# Altium schematic sheet I_Sense.SchDoc
size A4
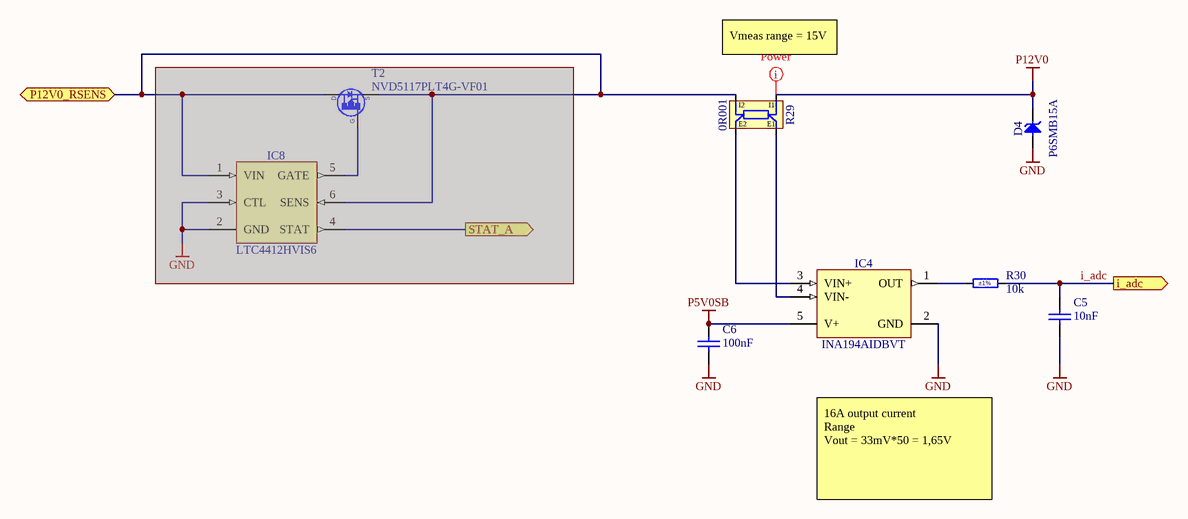
[diagram p0: I_Sense.SchDoc]

## Parts
C5  10nF  [CAPC1608X87N]
C6  100nF  [CAPC1608X87N]
D4  P6SMB15A  [DIOM5436X261N]
IC4  INA194AIDBVT  [SOT95P280X145-5N]
IC8  LTC4412HVIS6  [SOT95P280X100-6N]  (masked out: inside a compile mask, not in the netlist)
R29  0R001  [RES_VISHAY_WSL3637_0R001-0R0019]
R30  10k  Tolerance: ±1%  [RESC1608X55N]
T2  NVD5117PLT4G-VF01  [TO228P990X238-3N-R640X555]  (masked out: inside a compile mask, not in the netlist)

## Ports
i_adc (out), P12V0_RSENS (bidir), STAT_A (out)

## Nets
GND: C5.1 C6.2 D4.2(A) IC4.2(GND)
P5V0SB: C6.1 IC4.5(V+)
P12V0: D4.1(C) R29.I1
i_adc: C5.2 R30.2 ; port i_adc
P12V0_RSENS: R29.I2 ; port P12V0_RSENS
NetIC4_1: IC4.1(OUT) R30.1
NetIC4_3: IC4.3(VIN+) R29.E2
NetIC4_4: IC4.4(VIN-) R29.E1

## Layout directives
net class Power: P12V0

## Notes on the sheet
- (near R29) Vmeas range = 15V
- 16A output current
  Range
  Vout = 33mV*50 = 1,65V

## Library data of the parts
C5 = CC0603_10NF_50V_10%_X7R: Non-polarised capacitor; Part Description: SMD Multilayer Chip Ceramic Capacitor; Manufacturer: GENERIC; Manufacturer1 Part Number: 223858615636; Voltage: 50V; TC: X7R; Tolerance: ±10%; Part Number: CC0603_10NF_50V_10%_X7R; Component Kind: Standard; Component Type: Standard; Pin Count: 2; Value: 10nF; Status: Preferred; Manufacturer Part Number: CC0603_10NF_50V_10%_X7R; Case: 0603; Mounted: Yes; Socket: No; SMD: Yes; Sense: No; Manufacturer1 Example: PHYCOMP; Manufacturer1 ComponentHeight: 0.87mm; HelpURL: \\cern.ch\dfs\Applications\Altium\Datasheets\CC0603_X7R_PHYCOMP.pdf; Author: CERN DEM JLC; CreateDate: 03.12.2007; LatestRevisionDate: 03.12.2007
C6 = CC0603_100NF_50V_10%_X5R: Non-polarised capacitor; Part Description: SMD Multilayer Chip Ceramic Capacitor; Manufacturer: GENERIC; Manufacturer1 Part Number: C1608X5R1H104K080; Voltage: 50V; TC: X5R; Tolerance: ±10%; Part Number: CC0603_100NF_50V_10%_X5R; Component Kind: Standard; Component Type: Standard; Pin Count: 2; Value: 100nF; Status: None; Manufacturer Part Number: CC0603_100NF_50V_10%_X5R; Case: 0603; Mounted: Yes; Socket: No; SMD: Yes; Sense: No; Manufacturer1 Example: TDK; Manufacturer1 ComponentHeight: 0.9mm; HelpURL: \\cern.ch\dfs\Applications\Altium\Datasheets\CC0603_X5R_TDK_C.pdf; Author: CERN DEM MR; CreateDate: 08.01.2016; LatestRevisionDate: 08.01.2016
D4 = P6SMB15A: Transient Voltage Suppressor Diode (Uni-Directional); Part Description: Uni-directional Transient Voltage Suppressor (TVS) Diode; Manufacturer: LITTELFUSE; Voltage: 15V; Power: 600W; PressFit: No; Bonding: No; Part Number: P6SMB15A; Component Kind: Standard; Component Type: Standard; Device: P6SMB15A; PackageDescription: DO-214-AA/SMB Diode, Molded Body; 5.40mm L X 3.62mm W X 2.61mm H, IPC Medium Density; Manufacturer Part Number: P6SMB15A; Pin Count: 2; Case: SMB; Mounted: Yes; Socket: No; SMD: Yes; Sense: No; ComponentHeight: 2.61mm; HelpURL: \\cern.ch\dfs\Applications\Altium\Datasheets\P6SMB15A.pdf; Author: CERN DEM JLC; CreateDate: 12.07.2017; LatestRevisionDate: 12.07.2017
IC4 = INA194AIDBVT: Current Shunt Monitor -16V to +80V Common-Mode Range; Manufacturer: TEXAS INSTRUMENTS; PressFit: No; Bonding: No; Part Number: INA194AIDBVT; Component Kind: Standard; Component Type: Standard; Device: INA194AIDBVT; PackageDescription: SOT, 0.95mm Pitch; 5 Pin, 1.60mm W X 2.90mm L X 1.45mm H body, IPC Medium Density; Part Description: Current Shunt Monitor -16V to +80V Common-Mode Range; Manufacturer Part Number: INA194AIDBV; Pin Count: 5; Case: SOT23-5; Mounted: Yes; Socket: No; SMD: Yes; Sense: No; ComponentHeight: 1.45mm; Author: CERN DEM JLC; HelpURL: \\cern.ch\dfs\Applications\Altium\Datasheets\INA194AIDBVT.pdf; CreateDate: 10.05.2010; LatestRevisionDate: 10.05.2010
IC8 = LTC4412HVIS6#PBF: 36V, Low Loss PowerPathTM Controller in ThinSOT; Part Description: 36V, Low Loss PowerPath Controller in ThinSOT; Manufacturer: LINEAR TECHNOLOGY; PressFit: No; Bonding: No; Part Number: LTC4412HVIS6#PBF; Component Kind: Standard; Component Type: Standard; Device: LTC4412HVIS6; PackageDescription: SOT, 0.95mm Pitch; 6 Pin, 1.625mm W X 2.90mm L X 1.00mm H body, IPC Medium Density; Manufacturer Part Number: LTC4412HVIS6; Pin Count: 6; Case: SOT23-6; Mounted: Yes; Socket: No; SMD: Yes; Sense: No; ComponentHeight: 1mm; Author: CERN DEM JLC; HelpURL: \\cern.ch\dfs\Applications\Altium\Datasheets\LTC4412HVIS6#PBF.pdf; CreateDate: 22.03.2018; LatestRevisionDate: 02.02.2022
R29 = R3637_0R001_1%_3W_50PPM_VISHAY_WSL3637: Power and Current Sensing Resistor; Part Description: Power Metal Strip® Resistor, Low Value; Manufacturer: VISHAY DALE; Manufacturer Part Number: WSL36371L000FEA; Power: 3W; TC: ±75ppm/°C; Tolerance: ±1%; PressFit: No; Part Number: R3637_0R001_1%_3W_50PPM_VISHAY_WSL3637; Component Kind: Standard; Component Type: Standard; Pin Count: 4; Value: 0R001; Status: None; Case: 3637; Mounted: Yes; Sense: No; Socket: No; SMD: Yes; ComponentHeight: 0.89mm; HelpURL: \\cern.ch\dfs\Applications\Altium\Datasheets\R3637_VISHAY_WSL3637.pdf; Author: CERN DEM MR; CreateDate: 02.06.2016; LatestRevisionDate: 02.06.2016
R30 = R0603_10K_1%_0.1W_100PPM: Resistor - 1%; Part Description: General Purpose Thick Film Chip Resistor; Manufacturer: GENERIC; Manufacturer1 Part Number: NRC06F1002TRF; Power: 0.1W; TC: ±100ppm/°C; PressFit: No; Part Number: R0603_10K_1%_0.1W_100PPM; Component Kind: Standard; Component Type: Standard; Pin Count: 2; Value: 10k; Status: Preferred; Manufacturer Part Number: R0603_10K_1%_0.1W_100PPM; Case: 0603; Mounted: Yes; Sense: No; Socket: No; SMD: Yes; Manufacturer1 Example: NIC COMPONENT; Manufacturer1 ComponentHeight: 0.55mm; HelpURL: \\cern.ch\dfs\Applications\Altium\Datasheets\R0603_NIC_NRC.pdf; Author: CERN DEM JLC; CreateDate: 03.12.2007; LatestRevisionDate: 13.03.2008
T2 = NVD5117PLT4G-VF01: P-CHANNEL MOSFET WITH DIODE; Part Description: -60V, -61A, P-Channel Power MOSFET; Manufacturer: ON SEMICONDUCTOR; PressFit: No; Bonding: No; Part Number: NVD5117PLT4G-VF01; Component Kind: Standard; Component Type: Standard; Device: NVD5117PLT4G-VF01; PackageDescription: TO-252AA DPAK TO, 2.28mm pitch; 2 pin,9.90mm L X 6.56mm W X 2.38mm H body, IPC Medium Density; Manufacturer Part Number: NVD5117PLT4G-VF01; Pin Count: 3; Case: DPAK; Mounted: Yes; Socket: No; SMD: Yes; Sense: No; ComponentHeight: 2.38mm; HelpURL: \\cern.ch\dfs\Applications\Altium\Datasheets\NVD5117PLT4G-VF01.pdf; Author: CERN DEM BC; CreateDate: 12.09.2023; LatestRevisionDate: 12.09.2023